# Altium schematic sheet Charger_Sheet.SchDoc
size A4; SheetNumber: 1; SheetTotal: 2
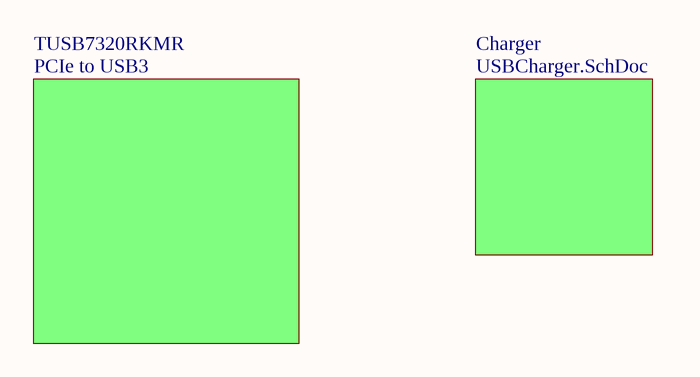
[diagram p0: Charger_Sheet.SchDoc]

## Sub-sheets
Charger = USBCharger.SchDoc: no entries
TUSB7320RKMR = PCIe to USB3: no entries